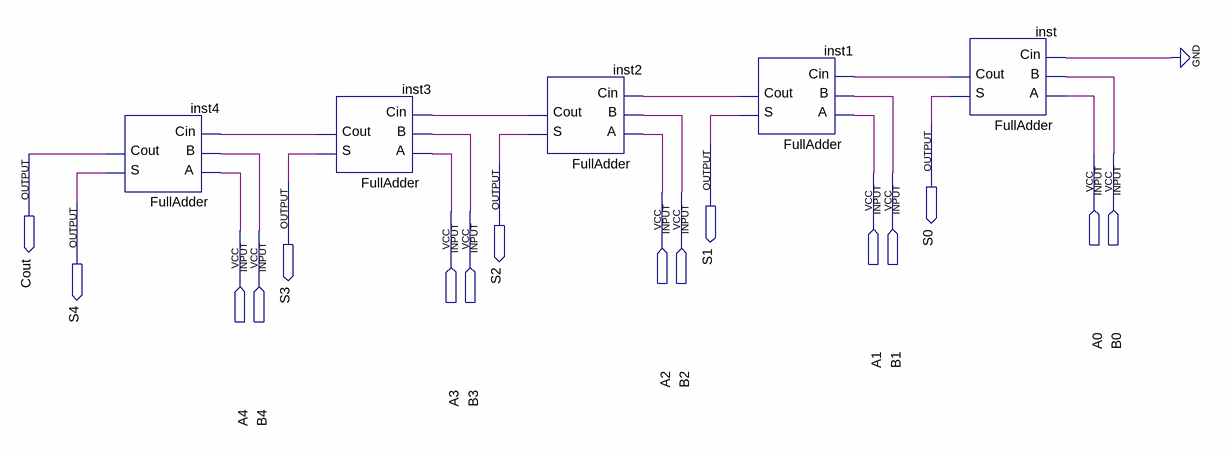
[diagram p0: schematic sheet]
// Quartus schematic Somador_5bits.bdf as structural Verilog: 5 symbols, 16 pins
module Somador_5bits (
  input  A0,
  input  B0,
  input  A1,
  input  B1,
  input  A2,
  input  B2,
  input  A3,
  input  B3,
  input  A4,
  input  B4,
  output S0,
  output S1,
  output Cout,
  output S2,
  output S3,
  output S4
);

  wire inst1_cout, inst2_cout, inst3_cout, inst_cout;

  FullAdder inst4 (.A(A4), .B(B4), .Cin(inst3_cout), .S(S4), .Cout(Cout));
  FullAdder inst3 (.A(A3), .B(B3), .Cin(inst2_cout), .S(S3), .Cout(inst3_cout));
  FullAdder inst2 (.A(A2), .B(B2), .Cin(inst1_cout), .S(S2), .Cout(inst2_cout));
  FullAdder inst1 (.A(A1), .B(B1), .Cin(inst_cout), .S(S1), .Cout(inst1_cout));
  FullAdder inst (.A(A0), .B(B0), .Cin(1'b0), .S(S0), .Cout(inst_cout));
endmodule
